# Altium project CH340_USB_To_UART.PrjPcb
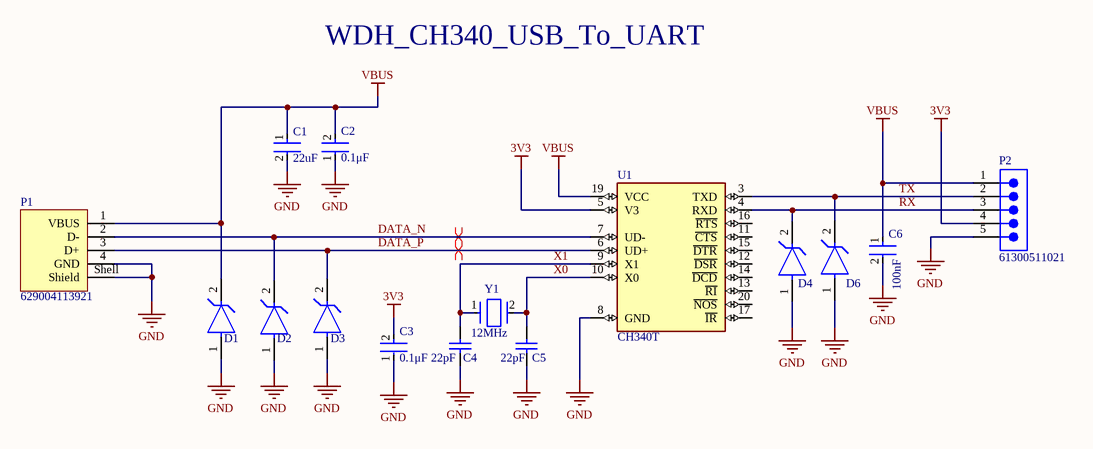
[diagram p0: CH340_USB_To_UART.SchDoc]
1 sheet, 15 parts. Net scope: global (net labels, ports and power ports of the same name join across sheets).
Board file: CH340_USB_To_UART.PcbDoc

## Sheet CH340_USB_To_UART.SchDoc
size B; SheetNumber: 1; SheetTotal: 1

### Parts
C1  value 22uF  [FP-CL05A226MQ5N6J8-IPC_C]  (hidden comment: CL05A226MQ5N6J8)
C2  Capacitance: 0.1μF  [FP-GRM15-MFG]  (hidden comment: GRM155R71C104KA88D)
C3  Capacitance: 0.1μF  [FP-GRM15-MFG]  (hidden comment: GRM155R71C104KA88D)
C4  Capactance: 22pF  [CAPC1006X50X20ML10T10]  (hidden comment: 0402ZK220GBSTR..)
C5  Capactance: 22pF  [CAPC1006X50X20ML10T10]  (hidden comment: 0402ZK220GBSTR..)
C6  Capacitance: 100nF  [FP-C1005-050-0_05-MFG]  (hidden comment: C1005X7R1C104K050BC)
D1  UCLAMP3601P.TNT  [FP-SLP1006P2-MFG]  (value not drawn)
D2  UCLAMP3601P.TNT  [FP-SLP1006P2-MFG]  (value not drawn)
D3  UCLAMP3601P.TNT  [FP-SLP1006P2-MFG]  (value not drawn)
D4  UCLAMP3601P.TNT  [FP-SLP1006P2-MFG]  (value not drawn)
D6  UCLAMP3601P.TNT  [FP-SLP1006P2-MFG]  (value not drawn)
P1  629004113921  [629004113921]
P2  61300511021  [61300511021]
U1  CH340T  [SSOP20W]
Y1  Parameter 1: 12MHz  [FP-ABM3-MFG]  (hidden comment: ABM3-12.000MHZ-D2Y-T)

### Nets
3V3: C3.2 P2.4 U1.5(V3)
GND: C1.2 C2.1 C3.1 C4.1 C5.1 C6.2 D1.1(A) D2.1(A) D3.1(A) D4.1(A) D6.1(A) P1.4(GND) P1.Shell(Shield) P2.5 U1.8(GND)
VBUS: C1.1 C2.2 C6.1 D1.2(C) P1.1(VBUS) P2.1 U1.19(VCC)
DATA_N: D2.2(C) P1.2(D-) U1.7(UD-)
DATA_P: D3.2(C) P1.3(D+) U1.6(UD+)
RX: D4.2(C) P2.3 U1.4(RXD)
TX: D6.2(C) P2.2 U1.3(TXD)
X0: C5.2 U1.10(X0) Y1.2
X1: C4.2 U1.9(X1) Y1.1

Not connected (* = marked no-connect by the designer): U1 11(~{CTS}) 12(~{DSR}) 13(~{RI}) 14(~{DCD}) 15(~{DTR}) 16(~{RTS}) 17(~{IR}) 20(~{NOS})

### Layout directives
differential pair: DATA_N, DATA_P

### Notes on the sheet
- WDH_CH340_USB_To_UART

### Library data of the parts
C1 = CMP-13271-000001-1: CAP CER 22UF 6.3V X5R 0402; Manufacturer: Samsung Electro-Mechanics; Material: Ceramic; Temperature Coefficient: 15%; Tolerance: 20%; Ipc Land Pattern Name: CAPC10050X50; Lead Free: Yes; Temperature Characteristic: X5R; Temperature: -55°C to +85°C; RoHS: TRUE; ComponentLink2Description: Datasheet; Device Class L3: Ceramic Capacitors; Device Class L1: Passive Components; Temperature Range High: +85°C; Automotive: No; Voltage Rating: 6.3V; Manufacturer Part Number: CL05A226MQ5N6J8; Package: 0402; Category: Cap; Device Class L2: Capacitors; Height: 0.55mm; ComponentLink2URL: http://www.samsungsem.com/kr/support/library/product-catalog/__icsFiles/afieldfile/2018/11/28/MLCC.pdf; Temperature Range Low: -55°C; Octopart: https://octopart.com/cl05a226mq5n6j8-samsung-82337113; Capacitance: 22uF; Digikey Description: CAP CER 22UF 6.3V X5R 0402
C2 C3 = CMP-2100-03641-2: CAP CER 0.1UF 16V X7R 0402; Manufacturer: Murata; Standoff Height: 0mm; Tolerance: 10%; Description: CAP Ceramic 0.10μF 10% X7R 16Vdc 0402 SMD; Voltage Rating: 16Vdc; Material: Ceramic; Value: 0.1μF; RoHS: TRUE; Manufacturer Part Number: GRM155R71C104KA88D; Temperature Characteristic: X7R; Octopart: https://octopart.com/grm155r71c104ka88d-murata-196880; Digikey Description: CAP CER 0.1UF 16V X7R 0402; Device Class L3: Ceramic Capacitors; Height: 0.55mm; ComponentLink2Description: Datasheet; Temperature Range Low: -55°C; Ipc Land Pattern Name: CAPC10050X219; ComponentLink2URL: https://search.murata.co.jp/Ceramy/image/img/A01X/G101/ENG/GRM155R71H471KA01-01A.pdf; Device Class L1: Passive Components; Lead Free: yes; Category: Cap; Package: GRM15; Temperature: -55°C to +125°C; Device Class L2: Capacitors; Temperature Range High: +125°C; Mouser Description: 0402 0.1 uF 16V ±10 % Tolerance X7R SMT Multilayer Ceramic Capacitor
C4 C5 = CMP-2008-04844-1: Manufacturer: AVX Interconnect / Elco; Part Number: 0402ZK220GBSTR..
C6 = CMP-08246-004182-1: Multilayer Ceramic Capacitors 100nF ±10% 16V X7R SMD 0402; Voltage: 16V; Depth: 0.5mm; Dielectric Material: Ceramic; Lead Free: Lead Free; Number of Pins: 2; Mount: Surface Mount; Radiation Hardening: No; Case/Package: 0402; Voltage Rating: 16V; Dielectric: X7R; Min Operating Temperature: -55°C; RoHS Compliant: Yes; Tolerance: 10%; Voltage Rating (DC): 16V; Max Operating Temperature: 125°C; Case Code (Metric): 1005; Height: 0.5mm; Thickness: 0.022inch; Package Quantity: 1; Packaging: Tape and Reel; Termination: SMD/SMT; Construction: Flat; Resistor Type: Ceramic; Length: 1mm; Case Code (Imperial): 0402; Width: 0.02inch; Series: C; Weight: 2.3E-05oz
D1-D4 D6 = CMP-56445-000005-1: TVS DIODE 33VWM 60VC SLP1006P2; Direction: Unidirectional; Min Breakdown Voltage: 36V; Leakage Current: 1uA; Peak Pulse Power: 125W; Power Line Protection: No; Number of Unidirectional Channels: 1; Clamping Voltage: 60V; Peak Pulse Current: 2A; Power Dissipation: 170W; Diode Type: ZENER; Element Configuration: Single; Reverse Standoff Voltage: 33V; Max Breakdown Voltage: 45V; Max Operating Temperature: 125°C; Resistor Type: Zener; Series: Automotive, AEC-Q100, uClamp®; Min Operating Temperature: -40°C; Case Code (Imperial): 0402; Number of Pins: 2; Lead Free: Lead Free; Case/Package: SMD/SMT; RoHS Compliant: Yes; Packaging: Tape and Reel; Clamping Voltage-Max: 60V; Depth: 0.6mm; Case Code (Metric): 1006; Length: 1mm; Radiation Hardening: No; Mount: Surface Mount; Working Voltage: 33V
P1 = CMP-1502-03242-2: NexarPartId: 19991169; USB Standard: USB 2.0; Gender: Male; Connector Type: USB; Contact Resistance: 20mΩ; Current Rating: 1.5A; Number of Contacts: 4; Insulation Resistance: 1GΩ; Operating Supply Voltage: 30V; Termination: SMD/SMT; Lead Free: Lead Free; Max Operating Temperature: 105°C; Mount: Horizontal, Surface Mount; Features: Shielded; Orientation: Horizontal; Length: 18.8mm; REACH SVHC: Unknown; Min Operating Temperature: -40°C; Contact Plating: Gold; Number of Pins: 4; RoHS: Compliant
P2 = CMP-1502-01067-3: NexarPartId: 32855525; Contact Resistance: 20mΩ; Current Rating: 3A; Number of Contacts: 5; Pitch: 2.54mm; Operating Supply Voltage: 250V; Connector Type: Male Pin; Gender: Male; Number of Rows: 1; Packaging: Bulk; REACH SVHC: Unknown; Mount: Through Hole; RoHS: Compliant; Termination: Solder; Contact Mating Length: 5.9944mm; Color: Black; Number of Positions: 5; Contact Plating: Gold; Number of Pins: 5; Contact Material: Copper; Lead Pitch: 2.54mm
U1 = CH340T: Interface Development Tools USB - Serial Convert with CH340T; MF: wch; SnapEDA_Link: https://www.snapeda.com/parts/CH340T/WCH/view-part/?ref=snap; Package: None; Value: *; MP: CH340T; Check_prices: https://www.snapeda.com/parts/CH340T/WCH/view-part/?ref=eda
Y1 = CMP-27762-007917-1: Crystal 12MHz ±20ppm 18pF SMD-2 5mm x 3.2mm; ESR (Equivalent Series Resistance): 60R; Frequency Stability: 30ppm; Depth: 3.2mm; Length: 5mm; Height: 0.051inch; Case/Package: CSMD; Package Quantity: 1000; Frequency: 12MHz; Packaging: Tape and Reel; Load Capacitance: 18pF; Min Operating Temperature: -40°C; Operating Frequency: 12 MHz; Number of Pins: 2; Termination: SMD/SMT; Tolerance: 20ppm; Mount: Surface Mount; Width: 0.126inch; Resistor Type: Ceramic; Frequency Tolerance: 20ppm; Lead Free: Lead Free; Max Operating Temperature: 85°C; Radiation Hardening: No; Series Resistance: 60R; Series: ABM3